# Altium schematic sheet 家庭智能控制系统.SchDoc
size A4
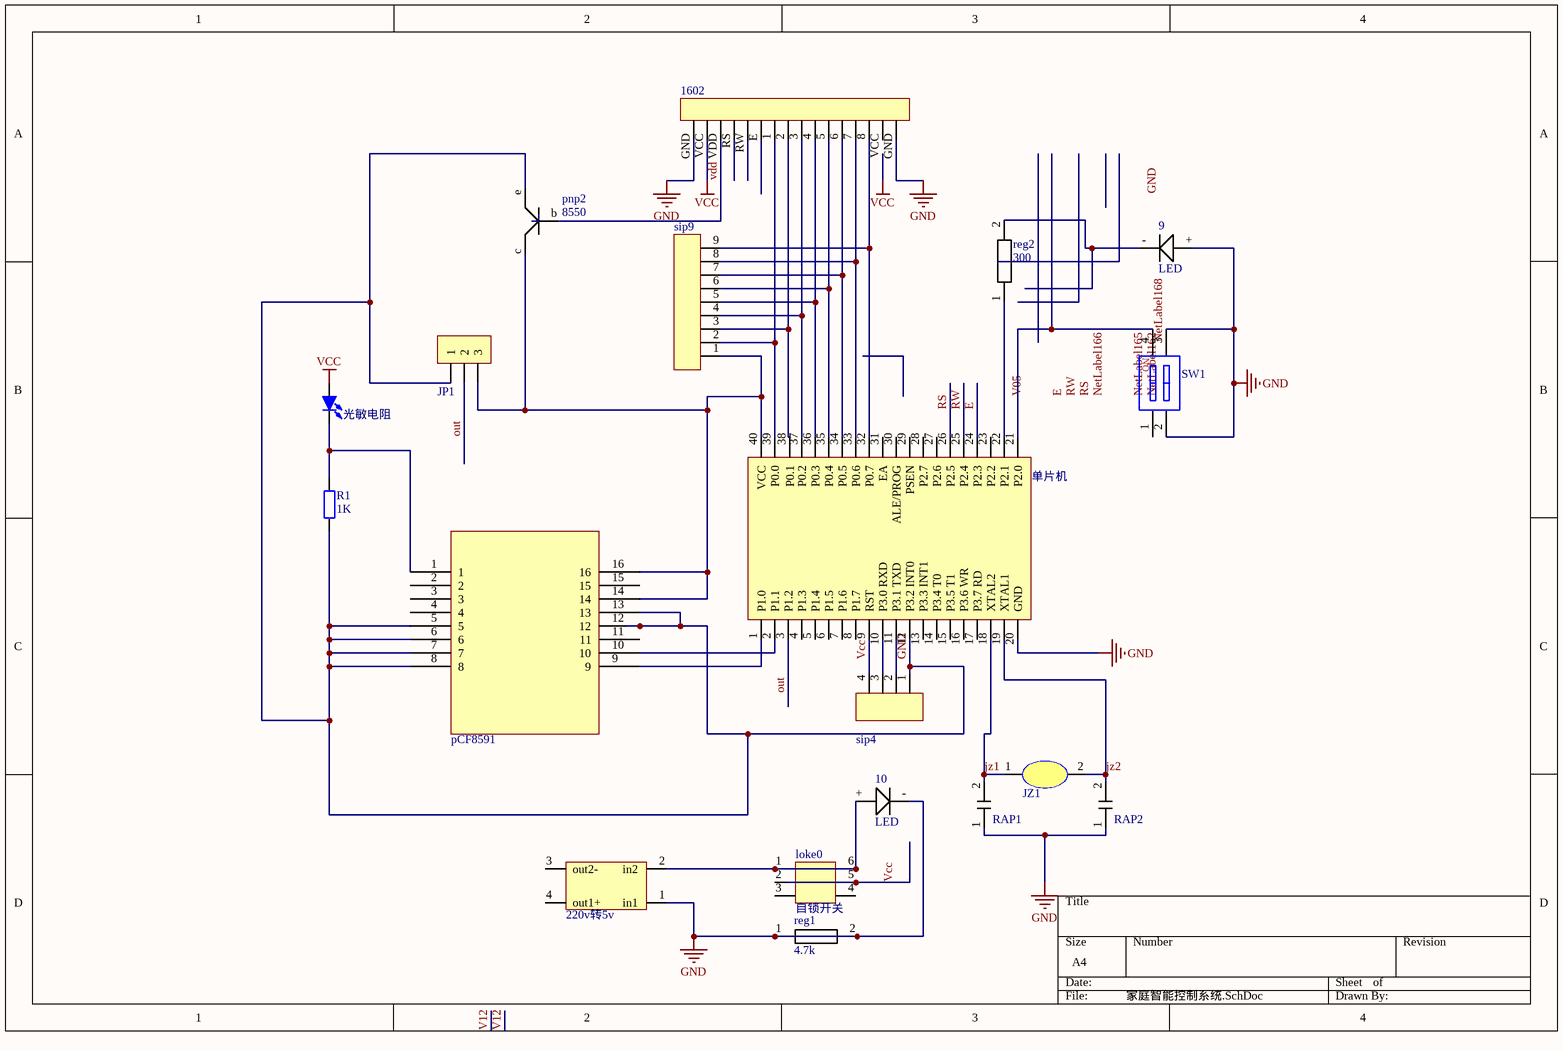
[diagram p0: 家庭智能控制系统.SchDoc]

## Parts
9  LED  [1n4148]
10  LED  [1n4148]
220v转5v  220v转5v  [220V转5v]
1602  1602  (value not drawn)
?  pCF8591
JP1  HDR-1X3  [ZH1.5-WI-3P]  (value not drawn)
JZ1  晶振  [晶振]  (value not drawn)
LED1  光敏电阻  [LED 5MM-B]
loke0  自锁开关  [开关]
pnp2  8550  [npn]
R1  1K  [R 0201-HP_L]
RAP1  电容  [CB1]  (value not drawn)
RAP2  电容  [CB1]  (value not drawn)
reg1  4.7k  [1/4W]
reg2  300  [1/4W]
sip4  sip4  [SIP4]  (value not drawn)
sip9  sip9  [SIP9]  (value not drawn)
SW1  CSW-2P  [CSW DIP-2P]  (value not drawn)
单片机  单片机  [DIP40]  (value not drawn)

## Nets
\: 9.+ 10.- 220v转5v.1(in1) 1602.GND ?.5 ?.6 ?.7 ?.8 ?.12 ?.13 JP1.1 pnp2.e R1.1 RAP1.1 RAP2.1 reg1.1 reg1.2 sip4.1 SW1.2 SW1.3 单片机.12(P3.2_INT0) 单片机.20(GND)  [also labelled GND]
Vcc: 1602.VCC LED1.1(A) loke0.5 sip4.4 单片机.9(RST)
E: 单片机.24(P2.3)
jz1: JZ1.1 RAP1.2 单片机.18(XTAL2)
jz2: JZ1.2 RAP2.2 单片机.19(XTAL1)
out: JP1.2 单片机.3(P1.2)
RS: 单片机.26(P2.5)
RW: 单片机.25(P2.4)
vdd: 1602.VDD pnp2.b
Net9_-: 9.- reg2.2
Net10_+: 10.+ 220v转5v.2(in2) loke0.1 loke0.6
Net1602_1: 1602.1 sip9.2 单片机.39(P0.0)
Net1602_2: 1602.2 sip9.3 单片机.38(P0.1)
Net1602_3: 1602.3 sip9.4 单片机.37(P0.2)
Net1602_4: 1602.4 sip9.5 单片机.36(P0.3)
Net1602_5: 1602.5 sip9.6 单片机.35(P0.4)
Net1602_6: 1602.6 sip9.7 单片机.34(P0.5)
Net1602_7: 1602.7 sip9.8 单片机.33(P0.6)
Net1602_8: 1602.8 sip9.9 单片机.32(P0.7)
Net?_1: ?.1 LED1.2(K) R1.2
Net?_9: ?.9 单片机.1(P1.0)
Net?_10: ?.10 单片机.2(P1.1)
Net?_14: ?.14 ?.16 JP1.3 pnp2.c sip9.1 单片机.40(VCC)
Netreg2_1: reg2.1 单片机.22(P2.1)
Netsip4_2: sip4.2 单片机.11(P3.1_TXD)
Netsip4_3: sip4.3 单片机.10(P3.0_RXD)
NetSW1_4: SW1.4 单片机.21(P2.0)

Not connected (* = marked no-connect by the designer): 220v转5v 3(out2-) 4(out1+); 1602 E RS RW; ? 2 3 4 11 15; loke0 2 3 4; SW1 1; 单片机 4(P1.3) 5(P1.4) 6(P1.5) 7(P1.6) 8(P1.7) 13(P3.3_INT1) 14(P3.4_T0) 15(P3.5_T1) 16(P3.6_WR) 17(P3.7_RD) 23(P2.2) 27(P2.6) 28(P2.7) 29(PSEN) 30(ALE/PROG) 31(EA)

## Notes on the sheet
- Labels drawn without touching a wire or pin: E, GND, NetLabel162, NetLabel165, NetLabel166, NetLabel168, RS, RW, V05
- (in symbol CSW-2P) NO

## Library data of the parts
9 10 = 二极管
? = Component_1
JP1 = Header 3: 3P接插件; 版权归属: 源创客; BOM名称: 3P接插件; 学习资源: www.ooocke.com
LED1 = LED-5MM: 5mm插件LED; 版权归属: 源创客; BOM名称: 5mm插件LED; 学习资源: www.ooocke.com
pnp2 = pnp
R1 = R-Precision: 精密贴片电阻; BOM名称: 精密电阻; 版权归属: 源创客; 学习资源: www.ooocke.com
reg1 reg2 = 电阻
SW1 = CSW-2P: 2路编码开关; 版权归属: 源创客; BOM名称: 2路编码开关; 学习资源: www.ooocke.com